# EAGLE design mapleCUx_med_010 (EAGLE 7.3.0)
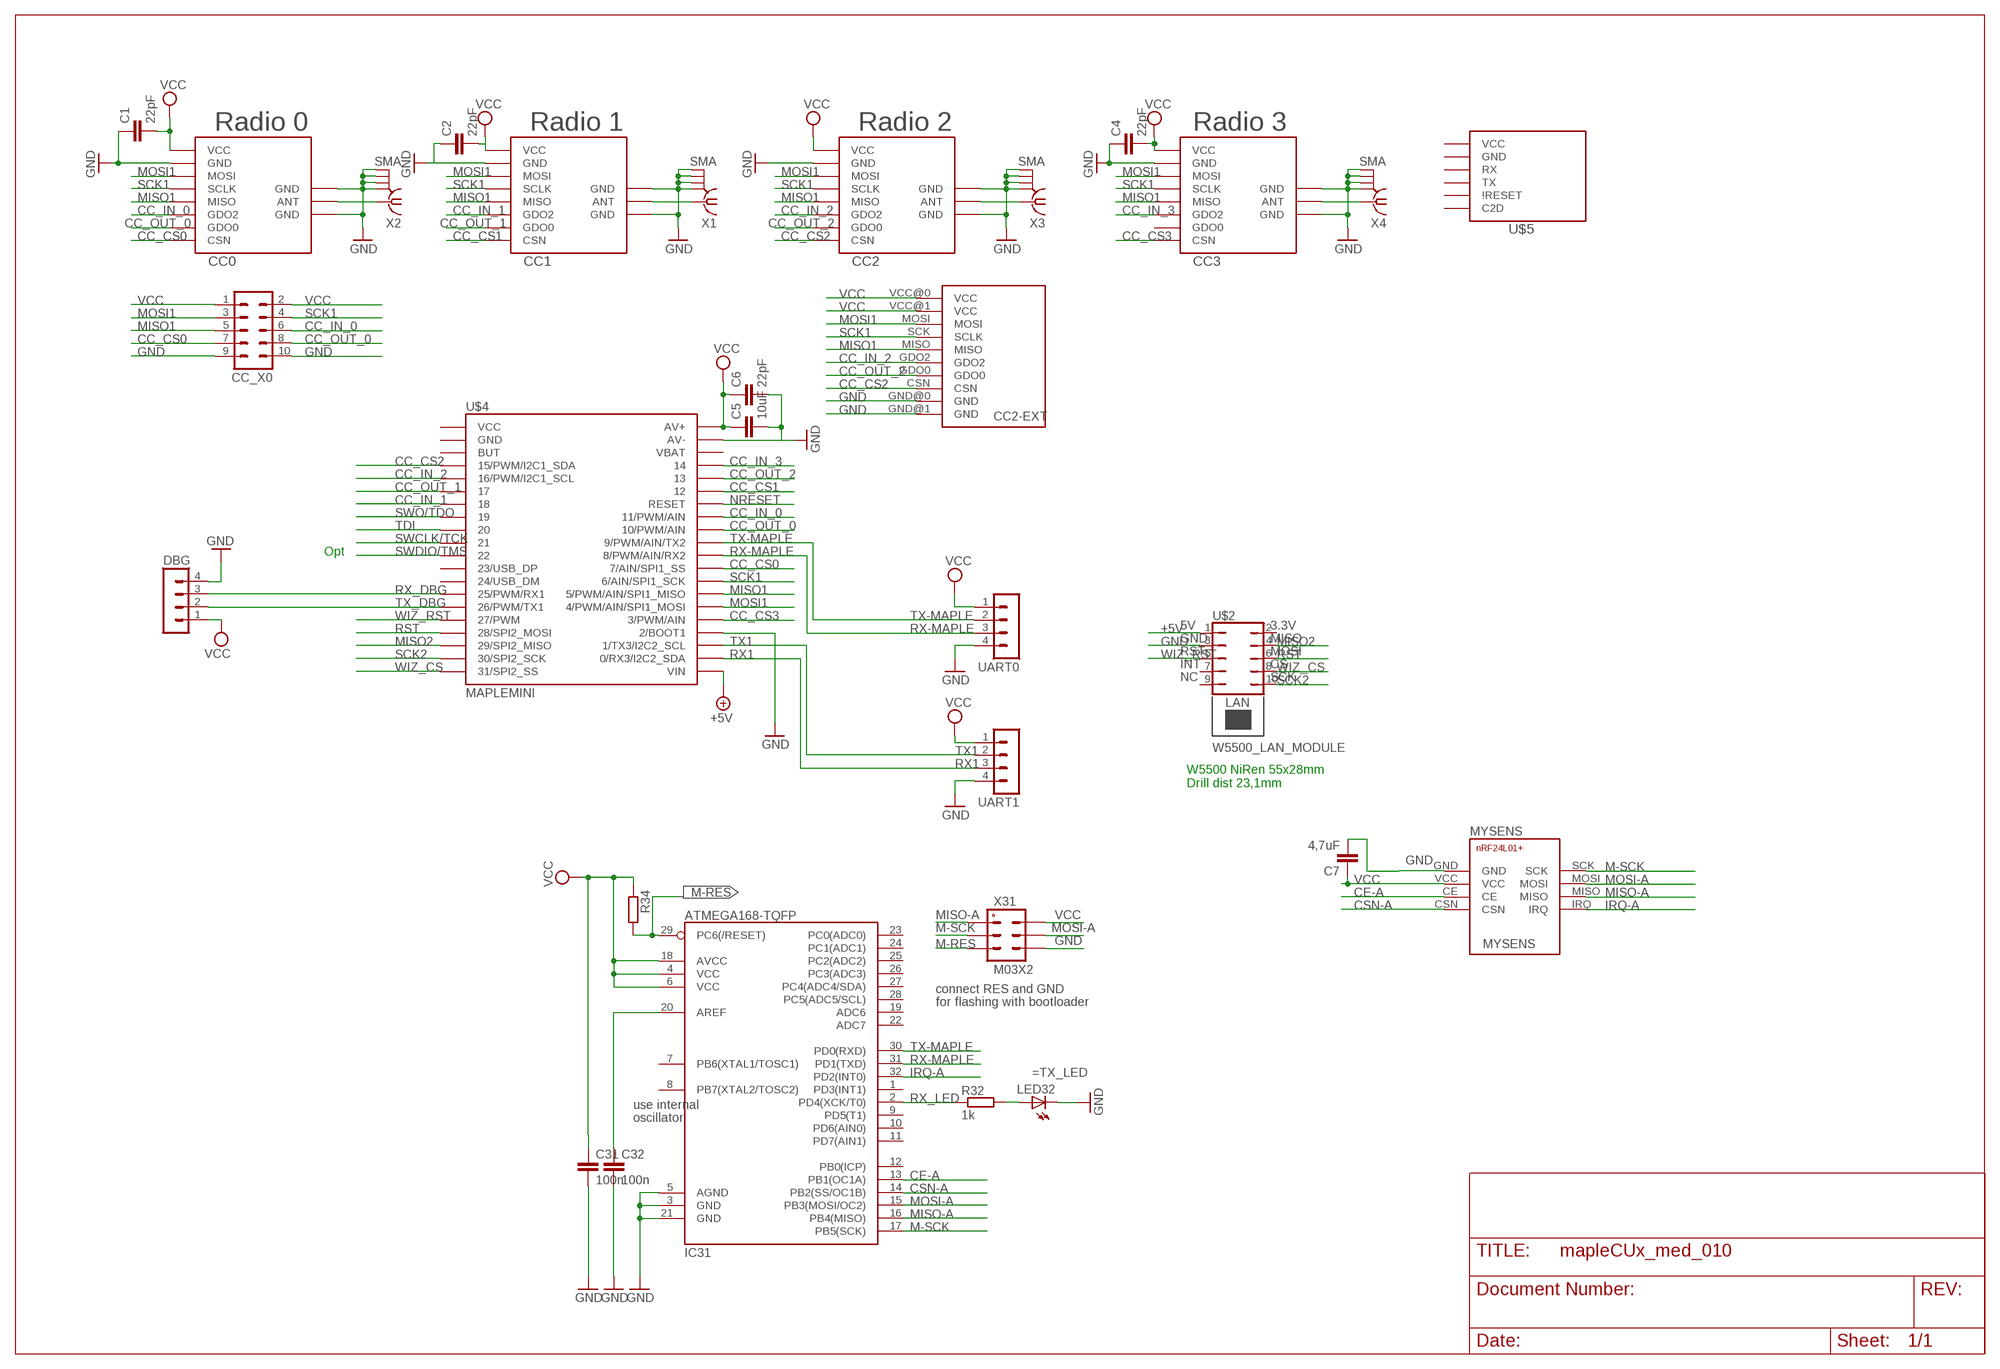
[diagram p0: schematic, sheet 1]

## Parts
C1  22pF  C-EUC0805  [C0805]
C2  22pF  C-EUC0805  [C0805]
C4  22pF  C-EUC0805  [C0805]
C5  10uF  C-EUC1210  [C1210]
C6  22pF  C-EUC0805  [C0805]
C7  4,7uF  C-EUC1210  [C1210]
C31  100n  C-EUC0805  [C0805]
C32  100n  C-EUC0805  [C0805]
CC0  CC1101_MODULE1SMD  [CC1101_MODULE1_SMD]
CC1  CC1101_MODULE1SMD  [CC1101_MODULE1_SMD]
CC2  CC1101_MODULE1SMD  [CC1101_MODULE1_SMD]
CC2-EXT  CC1101_MODULE3_DIL  [CC1101_MODULE3_DIL]
CC3  CC1101_MODULE1SMD  [CC1101_MODULE1_SMD]
CC_X0  MA05-2  [MA05-2]
DBG  MA04-1  [MA04-1]
IC31  ATMEGA168-TQFP  [TQFP32-08]
LED32  LEDCHIPLED_0805  [CHIPLED_0805]
MYSENS  NRF24L01+SMD  [NRF24L01+SMD]
R32  1k  R-EU_R0805  [R0805]
R34  R-EU_R0805  [R0805]
U$2  W5500_LAN_MODULE  [W5500_LAN_MODULE-1]
U$4  MAPLEMINI  [20-DIP]
U$5  HM-MOD-UARTDIL  [HM-MOD-UART-DIL]
UART0  MA04-1  [MA04-1]
UART1  MA04-1  [MA04-1]
X1  SMA  [SMA]
X2  SMA  [SMA]
X3  SMA  [SMA]
X4  SMA  [SMA]
X31  M03X2  [2X03-1.27MM_SMD]

## Nets
+5V: U$2.1 U$4.21(VIN)
CC_CS0: CC0.CSN CC_X0.7 U$4.29(7/AIN/SPI1_SS)
CC_CS1: CC1.CSN U$4.35
CC_CS2: CC2-EXT.CSN CC2.CSN U$4.4(15/PWM/I2C1_SDA)
CC_CS3: CC3.CSN U$4.25(3/PWM/AIN)
CC_IN_0: CC0.GDO2 CC_X0.6 U$4.33(11/PWM/AIN)
CC_IN_1: CC1.GDO2 U$4.7
CC_IN_2: CC2-EXT.GDO2 CC2.GDO2 U$4.5(16/PWM/I2C1_SCL)
CC_IN_3: CC3.GDO2 U$4.37
CC_OUT_0: CC0.GDO0 CC_X0.8 U$4.32(10/PWM/AIN)
CC_OUT_1: CC1.GDO0 U$4.6
CC_OUT_2: CC2-EXT.GDO0 CC2.GDO0 U$4.36
CE-A: IC31.13(PB1(OC1A)) MYSENS.CE
CSN-A: IC31.14(PB2(SS/OC1B)) MYSENS.CSN
GND [PWR]: C1.1 C2.1 C4.1 C5.2 C6.2 C7.2 C31.2 C32.2 CC0.GND@0(GND) CC0.GND@1(GND) CC0.GND@2(GND) CC1.GND@0(GND) CC1.GND@1(GND) CC1.GND@2(GND) CC2-EXT.GND@0(GND) CC2-EXT.GND@1(GND) CC2.GND@0(GND) CC2.GND@1(GND) CC2.GND@2(GND) CC3.GND@0(GND) CC3.GND@1(GND) CC3.GND@2(GND) CC_X0.9 CC_X0.10 DBG.4 IC31.3(GND) IC31.5(AGND) IC31.21(GND) LED32.C MYSENS.GND U$2.3 U$4.24(2/BOOT1) U$4.39(AV-) UART0.4 UART1.4 X1.GND@1 X1.GND@2 X1.GND@3 X1.GND@4 X2.GND@1 X2.GND@2 X2.GND@3 X2.GND@4 X3.GND@1 X3.GND@2 X3.GND@3 X3.GND@4 X4.GND@1 X4.GND@2 X4.GND@3 X4.GND@4 X31.P$6
IRQ-A: IC31.32(PD2(INT0)) MYSENS.IRQ
M-RES: IC31.29(PC6(/RESET)) R34.2 X31.P$5
M-SCK: IC31.17(PB5(SCK)) MYSENS.SCK X31.P$3
MISO1: CC0.MISO CC1.MISO CC2-EXT.MISO CC2.MISO CC3.MISO CC_X0.5 U$4.27(5/PWM/AIN/SPI1_MISO)
MISO2: U$2.4 U$4.18(29/SPI2_MISO)
MISO-A: IC31.16(PB4(MISO)) MYSENS.MISO X31.P$1
MOSI1: CC0.MOSI CC1.MOSI CC2-EXT.MOSI CC2.MOSI CC3.MOSI CC_X0.3 U$4.26(4/PWM/AIN/SPI1_MOSI)
MOSI-A: IC31.15(PB3(MOSI/OC2)) MYSENS.MOSI X31.P$4
N$1: CC2.ANT X3.1
N$2: CC3.ANT X4.1
N$3: CC1.ANT X1.1
N$4: CC0.ANT X2.1
N$5: LED32.A R32.2
N$15: C32.1 IC31.20(AREF)
NRESET: U$4.34(RESET)
RST: U$2.6 U$4.17(28/SPI2_MOSI)
RX1: U$4.22(0/RX3/I2C2_SDA) UART1.3
RX-MAPLE: IC31.31(PD1(TXD)) U$4.30(8/PWM/AIN/RX2) UART0.3
RX_DBG: DBG.3 U$4.14(25/PWM/RX1)
RX_LED: IC31.2(PD4(XCK/T0)) R32.1
SCK1: CC0.SCLK CC1.SCLK CC2-EXT.SCK(SCLK) CC2.SCLK CC3.SCLK CC_X0.4 U$4.28(6/AIN/SPI1_SCK)
SCK2: U$2.10 U$4.19(30/SPI2_SCK)
SWCLK/TCK: U$4.10
SWDIO/TMS: U$4.11
SWO/TDO: U$4.8
TDI: U$4.9
TX1: U$4.23(1/TX3/I2C2_SCL) UART1.2
TX-MAPLE: IC31.30(PD0(RXD)) U$4.31(9/PWM/AIN/TX2) UART0.2
TX_DBG: DBG.2 U$4.15(26/PWM/TX1)
VCC [PWR]: C1.2 C2.2 C4.2 C5.1 C6.1 C7.1 C31.1 CC0.VCC CC1.VCC CC2-EXT.VCC@0(VCC) CC2-EXT.VCC@1(VCC) CC2.VCC CC3.VCC CC_X0.1 CC_X0.2 DBG.1 IC31.4(VCC) IC31.6(VCC) IC31.18(AVCC) MYSENS.VCC R34.1 U$4.40(AV+) UART0.1 UART1.1 X31.P$2
WIZ_CS: U$2.8 U$4.20(31/SPI2_SS)
WIZ_RST: U$2.5 U$4.16(27/PWM)
Unconnected: CC3.GDO0 IC31.1(PD3(INT1)) IC31.7(PB6(XTAL1/TOSC1)) IC31.8(PB7(XTAL2/TOSC2)) IC31.9(PD5(T1)) IC31.10(PD6(AIN0)) IC31.11(PD7(AIN1)) IC31.12(PB0(ICP)) IC31.19(ADC6) IC31.22(ADC7) IC31.23(PC0(ADC0)) IC31.24(PC1(ADC1)) IC31.25(PC2(ADC2)) IC31.26(PC3(ADC3)) IC31.27(PC4(ADC4/SDA)) IC31.28(PC5(ADC5/SCL)) U$2.2 U$2.7 U$2.9 U$4.1(VCC) U$4.2(GND) U$4.3(BUT) U$4.12(23/USB_DP) U$4.13(24/USB_DM) U$4.38(VBAT) U$5.3(C2D) U$5.4(\!RESET) U$5.5(TX) U$5.6(RX)

## Notes on the sheet
- Radio 0 | Radio 1 | Radio 2 | Radio 3
- Opt
- W5500 NiRen 55x28mm
  Drill dist 23,1mm
- connect RES and GND
- for flashing with bootloader
- =TX_LED
- use internal
- oscillator

## Power pins joined to a net without a drawn wire
GND: U$5.2(GND)
VCC: U$5.1(VCC)

## Library data of the parts
C1 C2 C4-C7 C31 C32 = rcl:C-EU: CAPACITOR, European symbol
CC0 CC1-CC3 = wireless:CC1101_MODULE1: CC1101 wireless module for 433/868 MHz (sold from Aliexpress). DIL version for mounting with pin header (and SMD soldering) and SMD only variant available.
CC2-EXT = wireless:CC1101_MODULE3_DIL: 433 Mhz CC1101 wireless module named RF1101SE V3.1 package special has only limited silk screen on tPlace layer
CC_X0 = con-lstb:MA05-2: PIN HEADER; OC_FARNELL: unknown; OC_NEWARK: unknown
DBG UART0 UART1 = con-lstb:MA04-1: PIN HEADER; OC_FARNELL: unknown; OC_NEWARK: unknown
IC31 = atmel:ATMEGA168: Atmel Atmega 168/328/328P
LED32 = led:LED: LED OSRAM: - CHIPLED LG R971, LG N971, LY N971, LG Q971, LY Q971, LO R971, LY R971 LH N974, LH R974 LS Q976, LO Q976, LY Q976 LO Q996 - Hyper CHIPLED LW Q18S LB Q993, LB Q99A, LB R99A - SideLED LS A670, LO A670, LY A670, LG A670, LP A670 LB A673, LV A673, LT A673, LW A673 LH A674 LY A675 LS A676, LA A676, LO A676, LY A676, LW A676 LS A679, LY A679, LG A679 - Hyper Micro SIDELED® LS Y876, LA Y876, LO Y876, LY Y876 LT Y87S - SmartLED LW L88C, LW L88S LB L89C, LB L89S, LG L890 LS L89K, LO L89K, LY L89K LS L896, LA L896, LO L896, LY L896 - TOPLED LS T670, LO T670, LY T670, LG T670, LP T670 LSG T670, LSP T670, LSY T670, LOP T670, LYG T670 LG T671, LOG T671, LSG T671 LB T673, LV T673, LT T673, LW T673 LH T674 LS T676, LA T676, LO T676, LY T676, LB T676, LH T676, LSB T676, LW T676 LB T67C, LV T67C, LT T67C, LS T67K, LO T67K, LY T67K, LW E67C LS E67B, LA E67B, LO E67B, LY E67B, LB E67C, LV E67C, LT E67C LW T67C LS T679, LY T679, LG T679 LS T770, LO T770, LY T770, LG T770, LP T770 LB T773, LV T773, LT T773, LW T773 LH T774 LS E675, LA E675, LY E675, LS T675 LS T776, LA T776, LO T776, LY T776, LB T776 LHGB T686 LT T68C, LB T68C - Hyper Mini TOPLED® LB M676 - Mini TOPLED Santana® LG M470 LS M47K, LO M47K, LY M47K Source: http://www.osram.convergy.de LUXEON: - LUMILED® LXK2-PW12-R00, LXK2-PW12-S00, LXK2-PW14-U00, LXK2-PW14-V00 LXK2-PM12-R00, LXK2-PM12-S00, LXK2-PM14-U00 LXK2-PE12-Q00, LXK2-PE12-R00, LXK2-PE12-S00, LXK2-PE14-T00, LXK2-PE14-U00 LXK2-PB12-K00, LXK2-PB12-L00, LXK2-PB12-M00, LXK2-PB14-N00, LXK2-PB14-P00, LXK2-PB14-Q00 LXK2-PR12-L00, LXK2-PR12-M00, LXK2-PR14-Q00, LXK2-PR14-R00 LXK2-PD12-Q00, LXK2-PD12-R00, LXK2-PD12-S00 LXK2-PH12-R00, LXK2-PH12-S00 LXK2-PL12-P00, LXK2-PL12-Q00, LXK2-PL12-R00 Source: www.luxeon.com KINGBRIGHT: KA-3528ASYC Source: www.kingbright.com
MYSENS = wireless:NRF24L01+: nRF24L01+ Transceiver Module
R32 R34 = rcl:R-EU_: RESISTOR, European symbol
U$2 = lan:W5500_LAN_MODULE
U$4 = maplemini-mall:MAPLEMINI
U$5 = wireless:HM-MOD-UART: eQ3 HM-MOD-UART-AW-SH2 wireless module for 868 MHz. DIL version for mounting with pin header (antenna upwards) and SMD variant available (antenna downwards).
X1-X4 = sma:SMA: SMA 50 Ohm end launch jack receptacle - round contact
X31 = mechanics:M03X2

## Net classes
1 PWR: width 0.406 mm

## Board
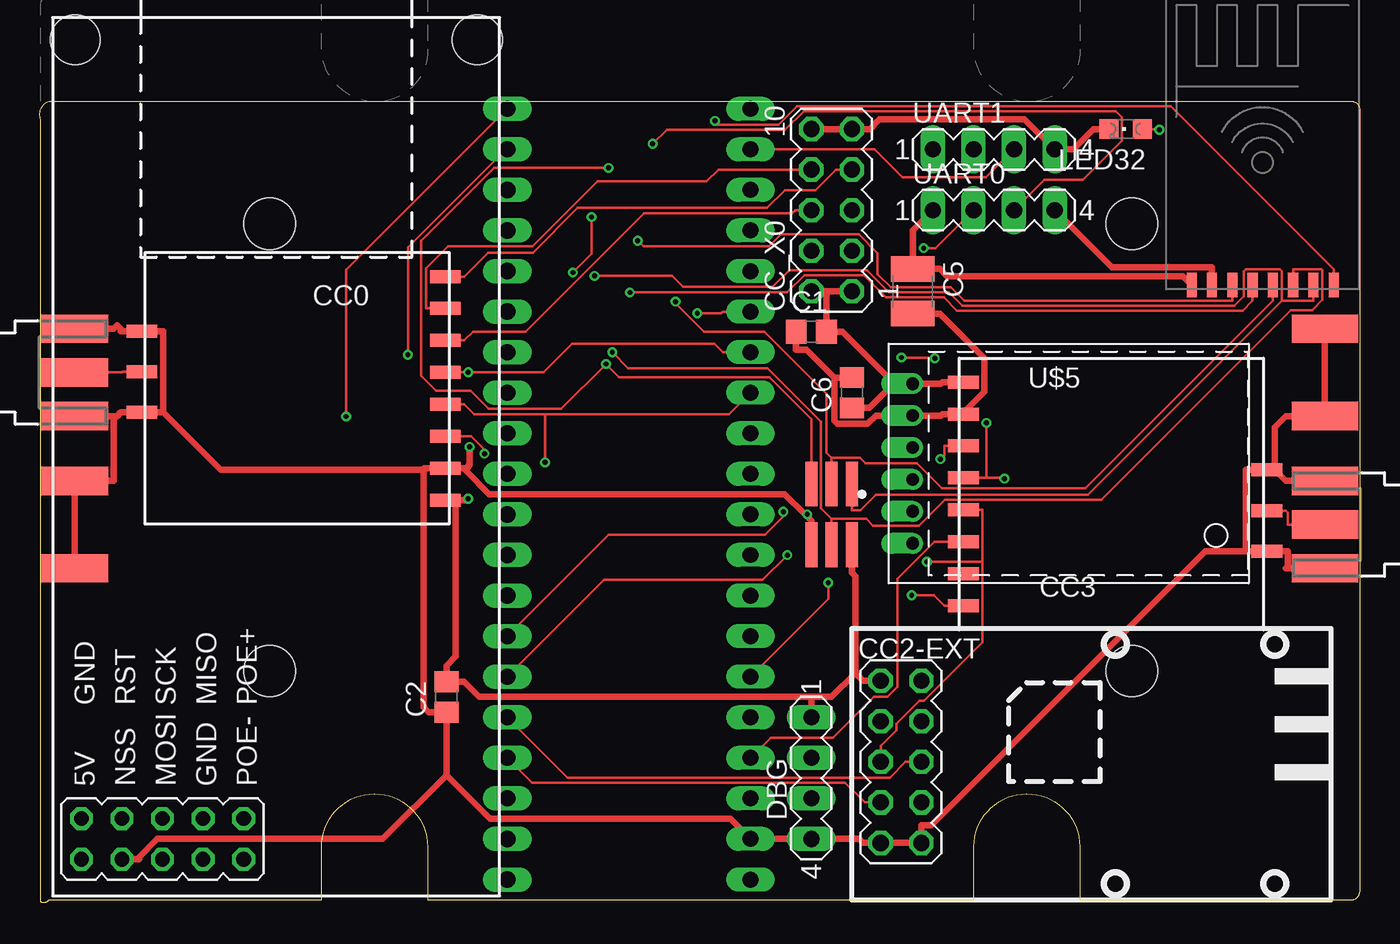
[diagram p1: board, top side]
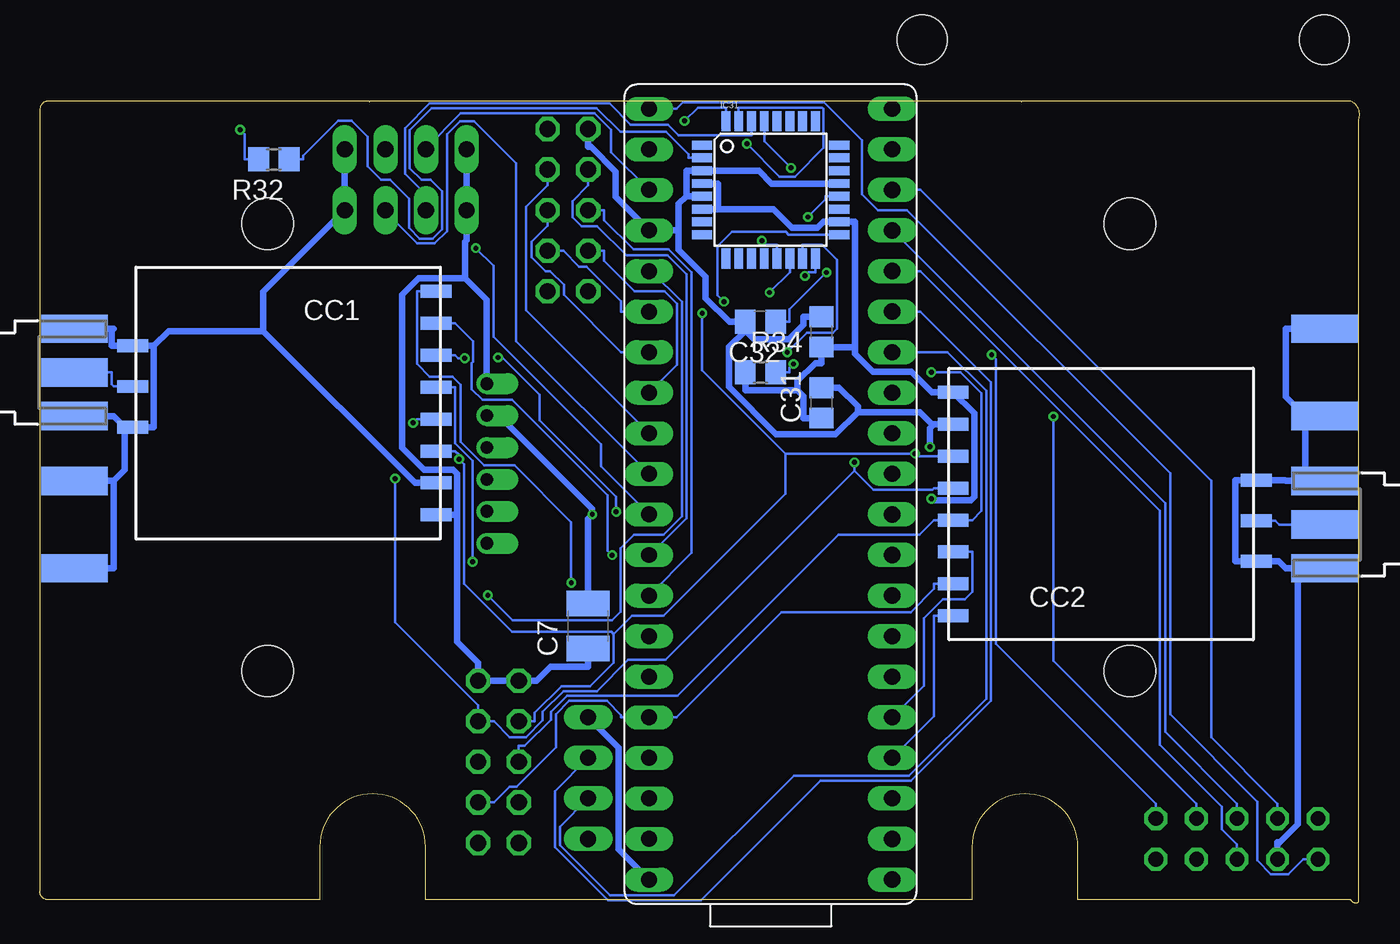
[diagram p2: board, bottom side, seen from below]

Size 82.66 x 50.18 mm. Coordinates in mm from the lower left corner, seen from the top.
Outline: 61.8,6.81 arc90 58.5,3.51 58.5,0.18 24.27,0.18 24.27,3.51 arc90 20.97,6.81 20.94,6.81 arc90 17.64,3.51 17.64,0.18 0.56,0.18 arc-90 0.06,0.05 0.06,49.05 arc-90 0.56,50.18 82.16,50.18 arc-90 82.66,49.68 82.66,0.68 arc-90 82.16,0.18 65.13,0.18 65.13,3.51 arc90 61.83,6.81
Outline: 21.17,50.15 21.14,50.15
Outline: 62.03,50.15 62,50.15
Copper layers (1*16): Top 0.035mm / dielectric 1.5mm / Bottom 0.035mm
Design rules "SeeedStudio_2layer_DRU_no_angle_20140221": minimum track width 6mil, minimum drill 12mil, track to track 6mil, track to pad 6mil, pad to pad 6mil, via to via 6mil, smd to smd 0mil, copper to edge 10mil, drill to drill 10mil, minimum pad ring 10mil, minimum via ring 6mil, stop-mask expansion 2mil, vias tented up to drill 100mil, thermal gap 10mil
Holes 3.2 mm at 14.39,14.51 14.39,42.51 68.39,42.51 68.39,14.51

### Footprints (pad centres in the part's own frame; a part is rotated, then mirrored left to right if it is on the bottom)
C0805 = smd 1.3 x 1.5: 1 -0.95,0; 2 0.95,0
C1210 = smd 1.6 x 2.7: 1 -1.4,0; 2 1.4,0
CC1101_MODULE1_SMD = smd 1.93 x 0.813: ANT 19,5.96; CSN 0,0; GDO0 0,2; GDO2 0,4; GND@0 0,12; GND@1 19,8.5; GND@2 19,3.42; MISO 0,6; MOSI 0,10; SCLK 0,8; VCC 0,14
CC1101_MODULE3_DIL = drill 1.016 octagon: CSN 1.81,6.1; GDO0 4.35,6.1; GDO2 4.35,8.64; GND@0 1.81,3.56; GND@1 4.35,3.56; MISO 1.81,8.64; MOSI 1.81,11.18; SCK 4.35,11.18; VCC@0 1.81,13.72; VCC@1 4.35,13.72
MA05-2 = drill 1.016 octagon: 1 -5.08,-1.27; 2 -5.08,1.27; 3 -2.54,-1.27; 4 -2.54,1.27; 5 0,-1.27; 6 0,1.27; 7 2.54,-1.27; 8 2.54,1.27; 9 5.08,-1.27; 10 5.08,1.27
MA04-1 = drill 1.016 long: 1 -3.81,0; 2 -1.27,0; 3 1.27,0; 4 3.81,0
TQFP32-08 = smd 1.27 x 0.559: 1 -4.293,2.8; 2 -4.293,2; 3 -4.293,1.2; 4 -4.293,0.4; 5 -4.293,-0.4; 6 -4.293,-1.2; 7 -4.293,-2; 8 -4.293,-2.8; 17 4.293,-2.8; 18 4.293,-2; 19 4.293,-1.2; 20 4.293,-0.4; 21 4.293,0.4; 22 4.293,1.2; 23 4.293,2; 24 4.293,2.8 | smd 0.559 x 1.27: 9 -2.8,-4.293; 10 -2,-4.293; 11 -1.2,-4.293; 12 -0.4,-4.293; 13 0.4,-4.293; 14 1.2,-4.293; 15 2,-4.293; 16 2.8,-4.293; 25 2.8,4.293; 26 2,4.293; 27 1.2,4.293; 28 0.4,4.293; 29 -0.4,4.293; 30 -1.2,4.293; 31 -2,4.293; 32 -2.8,4.293
CHIPLED_0805 = smd 1.2 x 1.2: A 0,-1.05; C 0,1.05
NRF24L01+SMD = smd 0.635 x 1.524: CE -1.575,-7.861; CSN -0.305,-7.861; GND -2.845,-7.861; IRQ 4.775,-7.861; MISO 3.505,-7.861; MOSI 2.235,-7.861; SCK 0.965,-7.861; VCC -4.115,-7.861
R0805 = smd 1.3 x 1.5: 1 -0.95,0; 2 0.95,0
W5500_LAN_MODULE-1 = drill 0.914 octagon: 1 0,0; 2 2.54,0; 3 0,-2.54; 4 2.54,-2.54; 5 0,-5.08; 6 2.54,-5.08; 7 0,-7.62; 8 2.54,-7.62; 9 0,-10.16; 10 2.54,-10.16 | hole 3.1: 51.3,0.4; 51.3,-24.8
20-DIP = drill 1.016 pad 1.27 long: 1 -24.13,-7.62; 2 -21.59,-7.62; 3 -19.05,-7.62; 4 -16.51,-7.62; 5 -13.97,-7.62; 6 -11.43,-7.62; 7 -8.89,-7.62; 8 -6.35,-7.62; 9 -3.81,-7.62; 10 -1.27,-7.62; 11 1.27,-7.62; 12 3.81,-7.62; 13 6.35,-7.62; 14 8.89,-7.62; 15 11.43,-7.62; 16 13.97,-7.62; 17 16.51,-7.62; 18 19.05,-7.62; 19 21.59,-7.62; 20 24.13,-7.62 | drill 1 pad 1.27 long: 21 24.13,7.62; 22 21.59,7.62; 23 19.05,7.62; 24 16.51,7.62; 25 13.97,7.62; 26 11.43,7.62; 27 8.89,7.62; 28 6.35,7.62; 29 3.81,7.62; 30 1.27,7.62; 31 -1.27,7.62; 32 -3.81,7.62; 33 -6.35,7.62; 34 -8.89,7.62; 35 -11.43,7.62; 36 -13.97,7.62; 37 -16.51,7.62; 38 -19.05,7.62; 39 -21.59,7.62; 40 -24.13,7.62
HM-MOD-UART-DIL = drill 0.8 offset: 1 0,12; 2 0,10; 3 0,8; 4 0,6; 5 0,4; 6 0,2
SMA = smd 4.191 x 1.778: 1 2.115,0; GND@1 2.115,2.733; GND@2 2.115,-2.733 | smd 4.191 x 1.778 bottom: GND@3 2.115,2.733; GND@4 2.115,-2.733
2X03-1.27MM_SMD = smd 0.75 x 2.8: P$1 -1.27,-1.905; P$2 -1.27,1.905; P$3 0,-1.905; P$4 0,1.905; P$5 1.27,-1.905; P$6 1.27,1.905

### Placement (x,y rotation side)
C1  48.32,35.74 0 top
C2  25.46,12.88 90 top
C4  33.71,35.74 270 bottom
C5  54.67,38.28 270 top
C6  50.86,31.93 90 top
C7  48.32,17.33 90 bottom
C31  33.71,31.3 90 bottom
C32  37.52,36.38 180 bottom
CC0  25.39,39.21 180 top
CC1  57.84,38.28 180 bottom
CC2  25.46,17.96 0 bottom
CC2-EXT  50.86,0.18 0 top
CC3  57.84,18.6 0 top
CC_X0  49.59,43.36 90 top
DBG  48.32,7.8 270 top
IC31  36.89,44.63 0 bottom
LED32  68,48.44 90 top
MYSENS  76.26,46.54 0 top
R32  68,46.54 180 bottom
R34  37.52,33.2 0 bottom
U$2  2.6,2.72 90 top
U$4  36.89,25.58 90 bottom
U$5  54.67,20.5 0 top
UART0  59.75,43.36 0 top
UART1  59.75,47.17 0 top
X1  82.61,33.2 0 bottom
X2  0.06,33.2 0 top
X3  0.06,23.68 180 bottom
X4  82.61,23.68 180 top
X31  49.59,24.31 180 top

### Tracks (layer width: path | path; a pad name or v marks a point on that pad's centre or on a via)
+5V
  Bottom 0.152: U$2.1 3.54,2.72 4.48,1.78 5.55,1.78 6.41,2.65 6.41,6.34 11.87,11.79 11.87,26.89 28.34,43.36 30.16,43.36 31.17,44.37 31.17,47.76 33.54,50.12 42.37,50.12 42.77,49.71 U$4.21
CC_CS0
  Top 0.152: CC0.CSN 26.58,39.21 28.09,40.71 30.89,40.71 33.69,43.51 45.55,43.51 46.65,44.61 48.57,44.61 49.87,45.9 CC_X0.7
  Bottom 0.152: CC_X0.7 50.86,44.91 52.2,43.57 52.2,37.09 U$4.29
CC_CS1  (via drill 0.3 pad 0.61)
  Top 0.152: U$4.35 49.38,19.02 v49.38,20.03
  Bottom 0.152: v49.38,20.03 49.38,23.84 52.94,27.4 54.83,27.4 56.3,28.87 56.3,32.45 56.8,32.95 58.24,32.95 59.04,33.74 59.04,38.28 CC1.CSN
CC_CS2
  Top 0.152: CC2-EXT.CSN 51.68,6.28 50.43,7.53 30.82,7.53 U$4.4
  Bottom 0.152: CC2.CSN 26.65,17.96 26.65,11.69 U$4.4
CC_CS3  (via drill 0.3 pad 0.61)
  Top 0.152: CC3.CSN 56.65,18.6 56,19.25 v54.61,19.25
  Bottom 0.152: v54.61,19.25 53.05,17.7 46.81,17.7 46.28,18.23 46.28,22.21 45.44,23.04 43.6,23.04 42.45,24.19 42.45,37.63 44.38,39.55 U$4.25
CC_IN_0
  Top 0.152: CC0.GDO2 26.58,35.21 27.12,35.74 30.42,35.74 37.83,43.16 47.12,43.16 47.33,43.36 CC_X0.6
  Bottom 0.152: U$4.33 41.84,21.9 41.84,39.47 43.29,40.91 45.49,40.91 47.33,42.74 47.33,43.36 CC_X0.6
CC_IN_1  (via drill 0.3 pad 0.61)
  Top 0.152: v53.97,34.14 56,34.14 v56.05,34.09 | U$4.7 35.62,23.04 45.4,23.04 46.57,24.2 v46.57,24.49
  Bottom 0.152: CC1.GDO2 56.65,34.28 56.46,34.09 v56.05,34.09 | v46.57,24.49 46.57,25.42 51.35,30.2 51.35,31.8 53.69,34.14 v53.97,34.14
CC_IN_2
  Top 0.152: U$4.5 33.05,7.83 53.23,7.83 54.22,8.82 CC2-EXT.GDO2
  Bottom 0.152: CC2.GDO2 24.27,21.96 24.27,19.46 24.71,19.01 26.11,19.01 27.3,17.82 27.3,13.58 U$4.5
CC_IN_3
  Top 0.152: U$4.37 45.78,10.34 49.66,10.34 52.23,12.91 53.1,12.91 53.7,13.52 53.7,20.29 56.02,22.6 56.65,22.6 CC3.GDO2
CC_OUT_0
  Top 0.152: CC_X0.8 47.33,45.9 42.5,45.9 41.77,45.17 34.92,45.17 30.85,41.1 25.56,41.1 24.2,39.74 24.2,37.21 CC0.GDO0
  Bottom 0.152: CC_X0.8 48.32,44.91 49.31,43.92 49.31,42.93 48.75,42.37 47.77,42.37 45.93,40.54 43.35,40.54 42.15,39.34 42.15,24.06 44.44,21.77 U$4.32
CC_OUT_1  (via drill 0.3 pad 0.61)
  Top 0.152: U$4.6 35.33,20.22 45.26,20.22 v46.81,21.77
  Bottom 0.152: v46.81,21.77 47.1,22.05 47.1,25.52 53.08,31.5 54.95,31.5 55.61,32.16 55.61,33.78 55.52,33.87 55.52,35.15 56.65,36.28 CC1.GDO0
CC_OUT_2
  Bottom 0.152: CC2-EXT.GDO0 54.22,6.28 53.23,7.27 52.79,7.27 50.34,9.72 50.34,11.82 49.52,12.64 47.15,12.64 46.25,11.73 46.25,11.61 U$4.36 44.2,11.61 42.77,11.61 36.2,18.19 28.11,18.19 26.65,19.65 26.65,19.96 CC2.GDO0
CE-A  (via drill 0.3 pad 0.61)
  Top 0.152: v37.44,41.45 37.8,41.09 45.68,41.09 46.43,41.84 51.29,41.84 52.47,40.66 52.47,39.35 53.3,38.52 57.08,38.52 57.91,37.69 74.68,37.69 MYSENS.CE
  Bottom 0.152: v37.44,41.45 37.2,41.2 36.49,41.2 IC31.13
CSN-A  (via drill 0.3 pad 0.61)
  Top 0.152: v36.95,38.21 46.8,38.21 47.88,39.3 51.61,39.3 52.99,37.91 56.61,37.91 57.44,37.08 75.34,37.08 75.95,37.69 MYSENS.CSN
  Bottom 0.152: v36.95,38.21 35.69,39.48 IC31.14
GND  (via drill 0.3 pad 0.61)
  Top 0.406: CC_X0.10 CC_X0.9 51.98,48.44 52.59,49.05 61.68,49.05 UART1.4 64.73,47.17 66,48.44 LED32.C | C1.1 47.37,34.64 48,34.64 49.75,32.88 | 49.75,32.88 49.75,30.17 49.95,29.98 51.83,29.98 52.35,30.5 U$5.2 56.43,30.5 56.52,30.6 57.18,30.6 | C6.2 49.75,32.88 | 25.46,7.99 28.19,5.26 43.24,5.26 U$4.39 46.44,3.99 DBG.4 51.3,3.99 51.55,3.74 CC2-EXT.GND@0 CC2-EXT.GND@1 55.21,4.86 55.85,4.86 73,22.02 75.52,22.02 | 26.71,27.21 26.92,27.41 v26.92,28.54 | 26.71,27.21 26.71,27.02 28.14,25.58 46.64,25.58 47.91,24.31 v48.06,24.31 48.06,24.17 48.32,23.91 X31.P$6 | 24.05,27.1 24.05,12.24 24.35,11.93 C2.1 25.46,7.99 | 24.05,27.1 24.07,27.12 24.07,27.21 CC0.GND@0 26.71,27.21 | 7.71,30.71 11.32,27.1 24.05,27.1 | 75.52,22.02 75.52,27.1 CC3.GND@1 77.36,27.1 | 75.52,22.02 CC3.GND@2 78.17,22.02 78.17,21.07 78.04,20.95 X4.GND@3 | MYSENS.GND 73.41,39.79 67.13,39.79 UART0.4 | 7.71,30.71 7.71,35.79 CC0.GND@2 5.07,35.79 5.07,35.93 4.85,36.15 4.63,35.94 X2.GND@3 | 77.36,27.1 78.04,26.41 X4.GND@4 | 77.36,27.1 77.36,29.78 78.04,30.47 X1.GND@4 X1.GND@3 | C5.2 56.38,36.88 59.17,34.09 59.17,32.01 57.76,30.6 57.18,30.6 | CC3.GND@0 57.18,30.6 | 25.46,7.99 21.46,3.99 7.34,3.99 6.21,2.85 6.21,2.72 U$2.3 | 4.63,30.47 4.83,30.47 5.07,30.71 CC0.GND@1 7.71,30.71 | X2.GND@4 4.63,30.47 | 4.63,30.47 4.63,26.41 X3.GND@4 X3.GND@3
  Bottom 0.406: 75.52,34.86 75.52,29.78 CC1.GND@1 77.36,29.78 | 68.67,35.79 59.17,26.28 CC1.GND@0 | 68.67,35.79 68.67,38.25 UART0.4 UART1.4 | 68.67,35.79 74.6,35.79 75.52,34.86 | 75.52,34.86 CC1.GND@2 78.17,34.86 78.17,35.81 78.04,35.94 X1.GND@3 | CC_X0.10 48.32,47.33 48.15,47.33 46.61,45.78 46.61,44.2 U$4.24 44.22,42.09 42.65,42.09 | IC31.21 36.83,45.03 37.63,45.83 IC31.3 42.17,45.83 42.17,44.23 | 26.65,29.96 26.78,29.96 27.54,30.72 31.43,30.72 | CC2.GND@0 26.65,29.96 | v26.92,28.54 26.92,29.7 26.65,29.96 | 38.47,35.83 37.92,35.27 35.75,35.27 34.82,36.2 34.82,36.69 C4.1 | 31.43,30.72 32.82,29.34 36.54,29.34 39.5,32.3 39.5,34.8 38.47,35.83 | C7.2 48.32,24.05 v48.06,24.31 48.06,24.66 53.91,30.5 U$5.2 | 42.17,44.23 42.65,43.76 42.65,42.09 | 42.65,42.09 42.65,40.88 40.96,39.19 40.96,37.85 39.48,36.38 C32.2 38.47,35.83 | IC31.5 42.17,44.23 | 31.43,30.72 31.43,31.07 32.61,32.25 C31.2 | 3.4,26.41 4.63,26.41 4.68,26.46 CC2.GND@1 7.78,26.46 7.78,21.38 CC2.GND@2 5.06,21.38 4.63,20.95 3.87,20.95 | X3.GND@4 3.4,26.41 | 3.4,26.41 3.4,30.47 | 78.04,26.41 77.36,27.1 77.36,29.78 | 78.04,26.41 78.04,20.95 X4.GND@3 | 77.36,29.78 78.04,30.47 X1.GND@4 | X2.GND@3 4.63,35.94 4.63,31.7 3.4,30.47 | X2.GND@4 3.4,30.47 | U$2.3 5.14,3.79 5.01,3.79 3.87,4.93 3.87,20.95 | X3.GND@3 3.87,20.95 | X4.GND@4 78.04,26.41
IRQ-A  (via drill 0.3 pad 0.61)
  Top 0.152: v42.28,48.95 42.52,48.71 46.26,48.71 47.42,49.88 70.82,49.88 81.03,39.67 MYSENS.IRQ
  Bottom 0.152: v42.28,48.95 41.44,49.79 39.69,49.79 IC31.32
M-RES  (via drill 0.3 pad 0.61)
  Top 0.152: v35.61,46.01 28.46,46.01 23.89,41.44 23.89,33 24.82,32.06 26.97,32.06 28.1,30.93 32.66,30.93 v35.46,33.73 36.27,32.92 45.69,32.92 48.32,30.28 48.32,27.85 X31.P$5
  Bottom 0.152: v35.46,33.73 35.7,33.49 35.7,33.2 R34.2 | IC31.29 37.29,47.69 v35.61,46.01
M-SCK  (via drill 0.3 pad 0.61)
  Top 0.152: 49.59,27.85 51.35,27.85 51.7,27.5 54.93,27.5 56.49,25.95 65.49,25.95 77.22,37.69 MYSENS.SCK | v39.8,37.64 39.8,37.53 41.6,35.74 45.39,35.74 49.26,31.87 49.26,28.18 49.59,27.85 | X31.P$3 49.59,27.85
  Bottom 0.152: IC31.17 35.76,41.83 35.93,42.01 39.3,42.01 40.2,41.1 40.2,38.04 v39.8,37.64
MISO1  (via drill 0.3 pad 0.61)
  Top 0.152: 59.04,21.35 v55.56,21.35 | 59.04,21.35 59.04,24.6 CC3.MISO | 59.04,21.35 59.04,16.31 55.36,12.63 55.08,12.63 53.66,11.22 53.66,10.8 52.67,9.81 CC2-EXT.MISO | U$4.27 42.77,34.47 42.25,34.99 33.34,34.99 31.55,33.21 v26.83,33.21 25.99,33.21 CC0.MISO
  Bottom 0.152: v55.56,21.35 55.56,27.69 56.65,28.78 56.65,32.28 CC1.MISO | v26.83,33.21 25.01,33.21 23.69,31.89 23.69,24.54 24.27,23.96 CC2.MISO 26.65,23.96 27.57,23.04 32.63,23.04 42.72,12.95 49.64,12.95 50.65,11.94 50.65,11.46 52.3,9.81 52.67,9.81 CC2-EXT.MISO | CC_X0.5 50.86,42.37 51.85,41.38 51.85,40.41 51,39.55 50.71,39.55 49.84,38.69 49.84,38.07 46.25,34.47 U$4.27
MISO2
  Bottom 0.152: U$4.18 27.52,44.63 9.3,26.42 9.3,10.37 5.14,6.2 U$2.4
MISO-A  (via drill 0.3 pad 0.61)
  Top 0.152: 77.78,37.69 65.65,25.55 52.35,25.55 51.39,24.59 50.86,24.59 X31.P$1 | 77.78,37.69 77.78,39.53 77.65,39.67 75.52,39.67 75.41,39.55 75.41,37.97 74.82,37.38 57.79,37.38 56.95,38.22 53.17,38.22 51.79,39.6 46.94,39.6 45.9,38.56 40.27,38.56 39.58,39.25 v34.74,39.25 | 77.78,37.69 79.76,37.69 MYSENS.MISO
  Bottom 0.152: v34.74,39.25 34.51,39.48 34.09,39.48 IC31.16
MOSI1  (via drill 0.3 pad 0.61)
  Top 0.152: CC3.MOSI 56.65,28.6 56.65,28.02 v56.41,27.78 | U$4.26 42.77,37.01 42.67,36.92 v41.18,36.92 | v27.84,28.12 27.84,28.37 27,29.21 26.58,29.21 CC0.MOSI
  Bottom 0.152: 46.72,16.82 46.86,16.96 53.07,16.96 56.09,19.98 56.09,27.46 v56.41,27.78 56.41,28.04 56.65,28.28 CC1.MOSI | 46.72,16.82 45.58,17.96 43.61,17.96 35.96,25.62 35.96,28.12 | 46.72,16.82 46.72,15.03 48.19,13.56 50,13.56 51.68,11.88 51.68,11.36 CC2-EXT.MOSI | 35.96,28.12 v27.84,28.12 27.68,27.96 26.65,27.96 CC2.MOSI | v41.18,36.92 41.18,33.34 35.96,28.12 | CC_X0.3 49.87,40.82 48.88,39.83 48.42,39.83 46.25,37.66 46.25,37.01 U$4.26
MOSI-A  (via drill 0.3 pad 0.61)
  Top 0.152: 49.59,24.04 51.77,24.04 52.19,23.62 55.06,23.62 56.68,25.23 66.47,25.23 78.35,37.11 79.68,37.11 80.34,37.76 80.34,39.6 80.27,39.67 78.49,39.67 MYSENS.MOSI | v35.85,34.46 36.85,33.47 45.59,33.47 48.92,30.13 48.92,24.7 49.59,24.04 | X31.P$4 49.59,24.04
  Bottom 0.152: v35.85,34.46 34.62,35.7 32.99,35.7 32.74,35.95 32.74,40.26 33.68,41.2 34.89,41.2 IC31.15
N$1
  Bottom 0.152: CC2.ANT 5.27,23.92 5.02,23.68 X3.1
N$2
  Top 0.152: X4.1 78.17,23.68 78.17,24.43 78.04,24.56 CC3.ANT
N$3
  Bottom 0.152: X1.1 78.17,33.2 78.17,32.46 78.04,32.32 CC1.ANT
N$4
  Top 0.152: CC0.ANT 5.2,33.25 5.15,33.2 X2.1
N$5  (via drill 0.3 pad 0.61)
  Top 0.152: v70.11,48.4 69.93,48.4 69.88,48.44 LED32.A
  Bottom 0.152: R32.2 69.83,46.54 69.83,48.12 v70.11,48.4
N$15  (via drill 0.3 pad 0.61)
  Top 0.152: v34.56,42.94 34.56,40.64 v33.38,39.46
  Bottom 0.152: v33.38,39.46 35.7,37.15 35.7,36.38 C32.1 | IC31.20 33.46,44.23 33.46,44.03 v34.56,42.94
RST
  Bottom 0.152: U$4.17 12.17,25 12.17,10.7 7.68,6.2 U$2.6
RX1
  Top 0.152: UART1.3 59.26,45.42 54.03,45.42 52.28,47.17 U$4.22
RX-MAPLE  (via drill 0.3 pad 0.61)
  Top 0.152: UART0.3 62.92,45.27 65.33,45.27 67.78,47.72 67.78,49.17 67.38,49.57 47.84,49.57 46.68,48.41 39.27,48.41 v38.38,47.52
  Bottom 0.152: v38.38,47.52 36.33,45.47 35.37,45.47 33.58,47.26 33.58,49.71 33.66,49.79 38.89,49.79 IC31.31 | U$4.30 52.82,35.17 52.82,46.31 55.45,48.94 56.34,48.94 57.17,48.11 57.17,42.04 57.92,41.28 59.03,41.28 61.02,43.27 UART0.3
RX_DBG
  Bottom 0.152: DBG.3 50.08,4.77 50.08,3.58 46.96,0.46 42.93,0.46 35.44,7.95 28.21,7.95 23.39,12.78 23.39,32.06 25.8,34.47 27.52,34.47 | 27.52,34.47 | U$4.14 27.52,34.47
RX_LED
  Bottom 0.152: IC31.2 42.05,46.63 42.05,46.86 43.45,48.26 46.3,48.26 47.78,49.74 58.11,49.74 59.49,48.36 59.49,46 58.76,45.27 58.18,45.27 57.47,44.56 57.47,42.16 58.05,41.59 58.87,41.59 59.54,42.25 59.54,44.07 60.73,45.27 61.28,45.27 62.14,46.13 62.14,47.96 63.14,48.96 63.97,48.96 66.18,46.76 66.18,46.54 R32.1
SCK1  (via drill 0.3 pad 0.61)
  Top 0.152: v60.41,26.55 60.37,26.6 59.28,26.6 | 59.28,26.6 CC3.SCLK | v59.28,30.04 59.28,26.6 | 31.64,30.59 27.2,30.59 26.58,31.21 CC0.SCLK | U$4.28 43.17,30.59 31.64,30.59 | v31.64,27.57 31.64,30.59
  Bottom 0.152: v60.41,26.55 60.41,17.56 55.21,12.35 CC2-EXT.SCK 54.71,11.36 54.22,11.36 53.23,10.37 52.22,10.37 51.17,11.42 51.17,11.96 49.88,13.26 47.77,13.26 45.81,15.21 43.48,15.21 31.64,27.05 | v59.28,30.04 59.04,30.28 CC1.SCLK | 31.64,27.05 30.45,25.86 26.75,25.86 26.65,25.96 CC2.SCLK | v31.64,27.57 31.64,27.05 | U$4.28 42.76,33.68 42.76,37.49 43.55,38.28 45.41,38.28 47.33,40.2 47.33,40.82 CC_X0.4
SCK2  (via drill 0.3 pad 0.61)
  Top 0.152: U$4.19 29.19,47.17 23.05,41.03 v23.05,34.31
  Bottom 0.152: v23.05,34.31 22.78,34.04 22.78,16.22 12.76,6.2 U$2.10
TX1
  Bottom 0.152: UART1.2 58.48,47.25 56.3,49.43 47.91,49.43 46.87,48.4 46.87,47 U$4.23
TX-MAPLE  (via drill 0.3 pad 0.61)
  Top 0.152: v55.36,40.99 56.11,40.99 UART0.2
  Bottom 0.152: UART0.2 58.48,44.32 59.8,45.64 59.8,48.49 58.24,50.04 46.99,50.04 45.66,48.72 43.32,48.72 42.67,48.06 38.09,48.06 IC31.30 | U$4.31 47.53,27.33 47.53,28.72 54.24,35.43 54.24,39.87 v55.36,40.99
TX_DBG
  Bottom 0.152: DBG.2 50.4,7 50.4,3.46 47.09,0.15 41.26,0.15 33.76,7.65 28.09,7.65 23.08,12.65 23.08,32.58 27.52,37.01 U$4.15
VCC  (via drill 0.3 pad 0.61)
  Top 0.406: 53.5,32.52 53.51,32.5 U$5.1 56.43,32.5 56.52,32.6 CC3.VCC | 53.5,32.52 50.28,35.74 C1.2 49.27,36.85 49.27,38.28 | 53.5,32.52 51.97,30.98 C6.1 | 48.32,12.88 27.52,12.88 26.57,13.83 C2.2 25.46,14.84 26.05,15.43 26.05,25.21 | 51.08,14.37 49.59,12.88 48.32,12.88 | 48.32,12.88 DBG.1 | 51.08,14.37 51.08,20.43 50.86,20.65 X31.P$2 | 51.08,14.37 51.55,13.9 CC2-EXT.VCC@0 | MYSENS.VCC 71.59,39.24 56.82,39.24 56.38,39.68 C5.1 54.67,42.09 UART0.1 | 26.05,25.21 26.71,25.21 26.8,25.29 v26.83,25.29 | CC0.VCC 26.05,25.21 | 49.27,38.28 CC_X0.1 | CC_X0.2 49.27,38.28
  Bottom 0.406: 56.52,24.28 56.52,26.87 56.77,27.11 58.59,27.11 59.96,28.48 59.96,38.06 58.93,39.09 56.02,39.09 | 56.02,39.09 54.67,37.74 U$5.1 | 56.02,39.09 56.02,41.4 55.94,41.48 UART0.1 UART1.1 | 56.52,24.28 56.52,16.34 55.21,15.02 CC2-EXT.VCC@1 CC2-EXT.VCC@0 51.55,13.9 50.68,14.77 48.32,14.77 C7.1 | CC1.VCC 56.52,24.28 | 31.61,34.79 31.61,34.39 30.47,33.25 28.07,33.25 26.78,31.96 CC2.VCC 24.14,30.64 24.14,25.41 24.35,25.2 26.73,25.2 v26.83,25.29 | 31.61,34.79 31.61,42.63 IC31.18 33.59,42.63 33.95,42.27 35.55,42.27 36.72,43.43 40.19,43.43 | 31.61,34.79 32.61,34.79 C4.2 33.71,33.79 34.09,33.79 35.19,32.68 35.19,32.1 | DBG.1 46.4,9.7 46.4,3.35 U$4.40 | 40.19,43.43 40.19,45.03 IC31.4 | IC31.6 40.19,43.43 | C31.1 34.82,30.35 34.82,31.72 35.19,32.1 | 35.19,32.1 38.47,32.1 R34.1
WIZ_CS  (via drill 0.3 pad 0.61)
  Top 0.152: U$4.20 19.18,39.63 v19.18,30.44
  Bottom 0.152: v19.18,30.44 19.18,15.17 10.22,6.2 U$2.8
WIZ_RST
  Bottom 0.152: U$4.16 27.52,39.55 12.51,24.55 12.51,9.9 8.62,6.01 8.62,4.6 7.68,3.66 U$2.5